# EAGLE design esp12_shield (EAGLE 6.5.0)
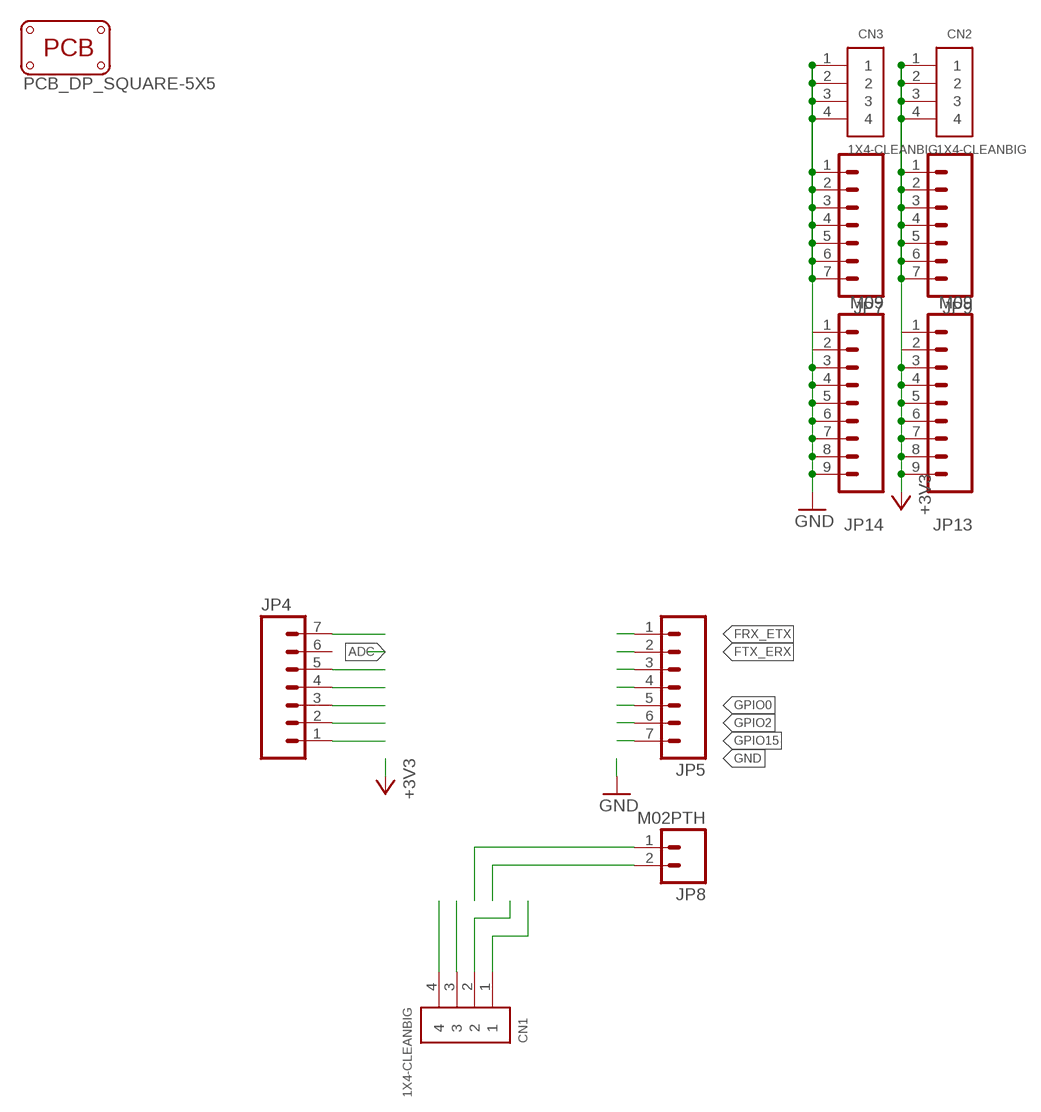
[diagram p0: schematic, sheet 1]

## Parts
CN1  1X4-CLEANBIG  [1X04-CLEANBIG]
CN2  1X4-CLEANBIG  [1X04-CLEANBIG]
CN3  1X4-CLEANBIG  [1X04-CLEANBIG]
JP4  M07  [1X07]
JP5  M07  [1X07]
JP7  M07  [1X07]
JP8  M02PTH  [1X02]
JP9  M07  [1X07]
JP13  M09  [1X09]
JP14  M09  [1X09]
PCB1  PCB_DP_SQUARE-5X5  [DP5050_V1]

## Nets
+3V3: CN2.1 CN2.2 CN2.3 CN2.4 JP9.1 JP9.2 JP9.3 JP9.4 JP9.5 JP9.6 JP9.7 JP13.1 JP13.2 JP13.3 JP13.4 JP13.5 JP13.6 JP13.7 JP13.8 JP13.9
CH_PD: JP4.5
FRX_ETX: JP5.1
FTX_ERX: JP5.2
GND: CN3.1 CN3.2 CN3.3 CN3.4 JP7.1 JP7.2 JP7.3 JP7.4 JP7.5 JP7.6 JP7.7 JP14.1 JP14.2 JP14.3 JP14.4 JP14.5 JP14.6 JP14.7 JP14.8 JP14.9
GPIO0: JP5.5
GPIO2: JP5.6
GPIO15: JP5.7
N$1: JP4.7
N$2: CN1.4
N$3: JP4.1
N$4: JP4.2
N$5: JP4.3
N$6: CN1.3
N$7: JP4.4
N$10: CN1.2
N$11: CN1.1
N$14: JP5.4
N$15: JP5.3
N$16: JP8.1
N$17: JP8.2
Unconnected: JP4.6

## Library data of the parts
CN1-CN3 = adafruit:1X4: 4-pin connector
JP4 JP5 JP7 JP9 = SparkFun-Connectors:M07: Header 7 Standard 7-pin 0.1" header. Use with straight break away headers (SKU : PRT-00116), right angle break away headers (PRT-00553), swiss pins (PRT-00743), machine pins (PRT-00117), and female headers (PRT-00115). NOTES ON THE VARIANTS LOCK and LOCK_LONGPADS... This footprint was designed to help hold the alignment of a through-hole component (i.e. 7-pin header) while soldering it into place. You may notice that each hole has been shifted either up or down by 0.005 of an inch from it's more standard position (which is usually a perfectly straight line). This slight alteration caused the pins (the squares in the middle) to touch the edges of the holes. Because they are alternating, it causes a "brace" to hold the header in place. 0.005 has proven to be the perfect amount of "off-center" position when using our standard breakaway headers. Although looks a little odd when you look at the bare footprint, once you have a header in there, the alteration is very hard to notice. Also, if you push a header all the way into place, it is covered up entirely on the bottom side. This idea of altering the position of holes to aid alignment will be further integrated into the Sparkfun Library for other footprints. It can help hold any component with 3 or more connection pins.
JP8 = SparkFun-Connectors:M02: Standard 2-pin 0.1" header. Use with - straight break away headers ( PRT-00116) - right angle break away headers (PRT-00553) - swiss pins (PRT-00743) - machine pins (PRT-00117) - female headers (PRT-00115) Molex polarized connector foot print use with: PRT-08233 with associated crimp pins and housings. 2.54_SCREWTERM for use with PRT-10571. 3.5mm Screw Terminal footprints for PRT-08084 5mm Screw Terminal footprints for use with PRT-08432
JP13 JP14 = SparkFun-Connectors:M09: Header 9 Standard 9-pin 0.1" header. Use with straight break away headers (SKU : PRT-00116), right angle break away headers (PRT-00553), swiss pins (PRT-00743), machine pins (PRT-00117), and female headers (PRT-00115).
PCB1 = dp_pcb:PCB_DP_SQUARE: Dangerous Prototypes Standard Square PCB sizes

## Board
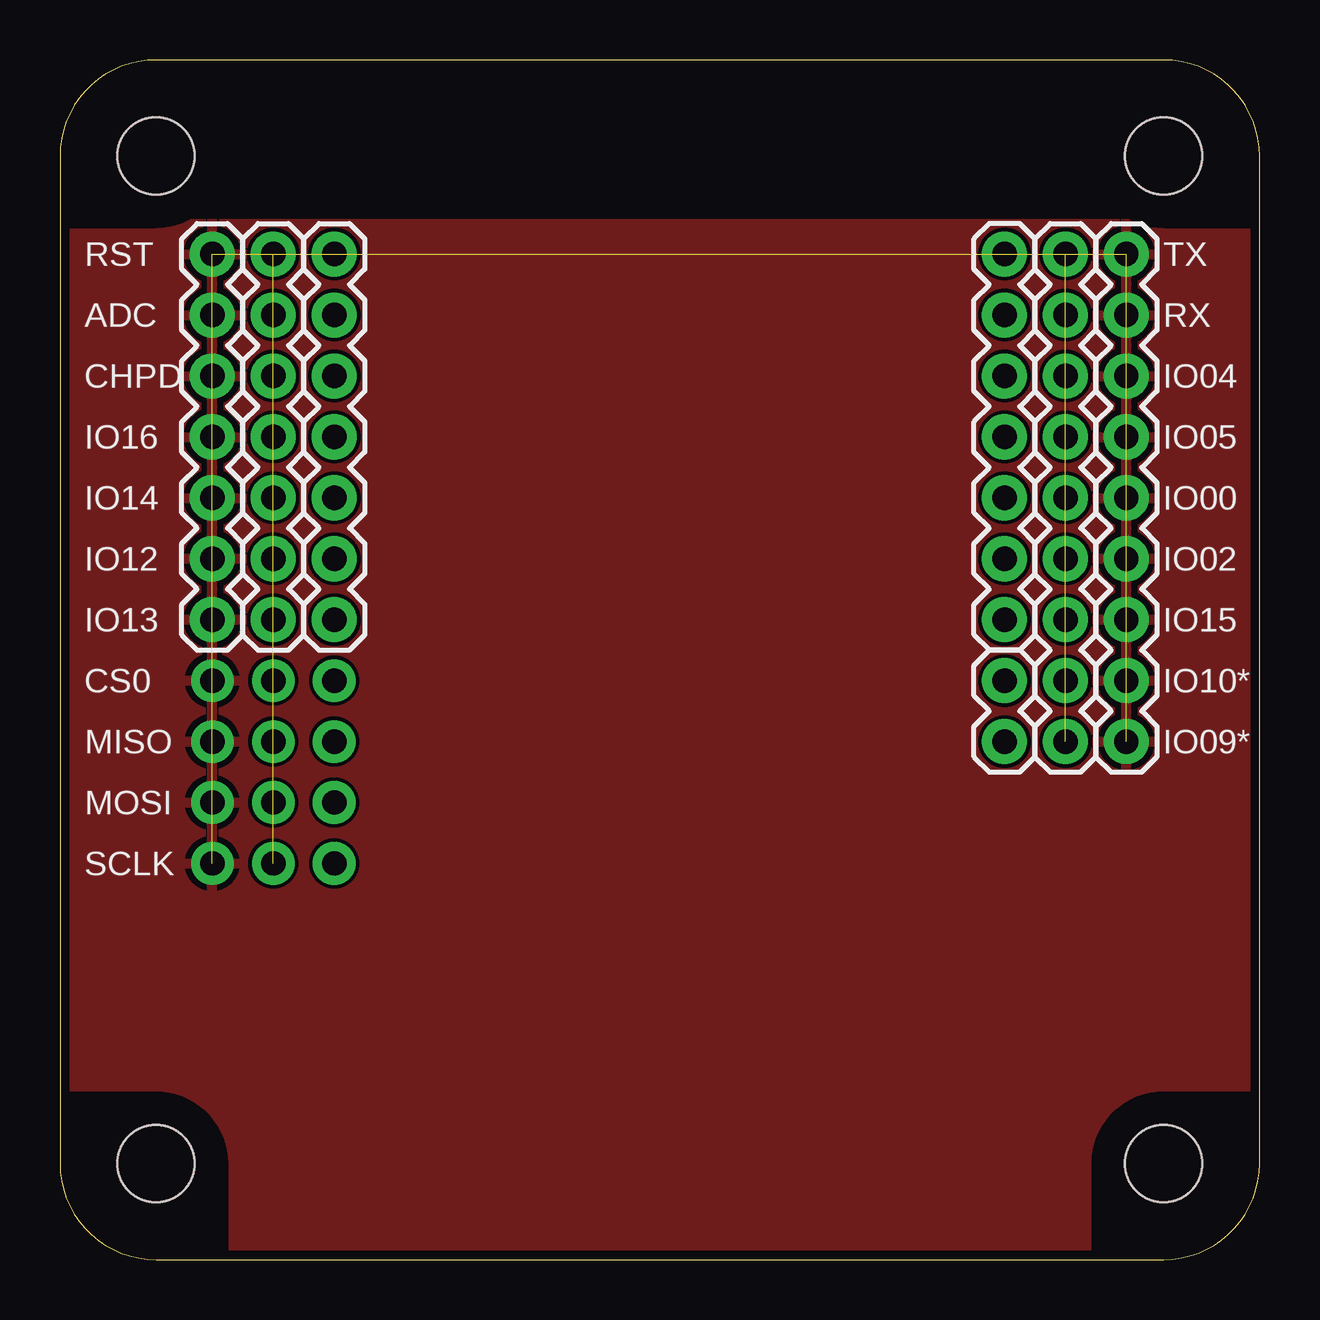
[diagram p1: board, top side]
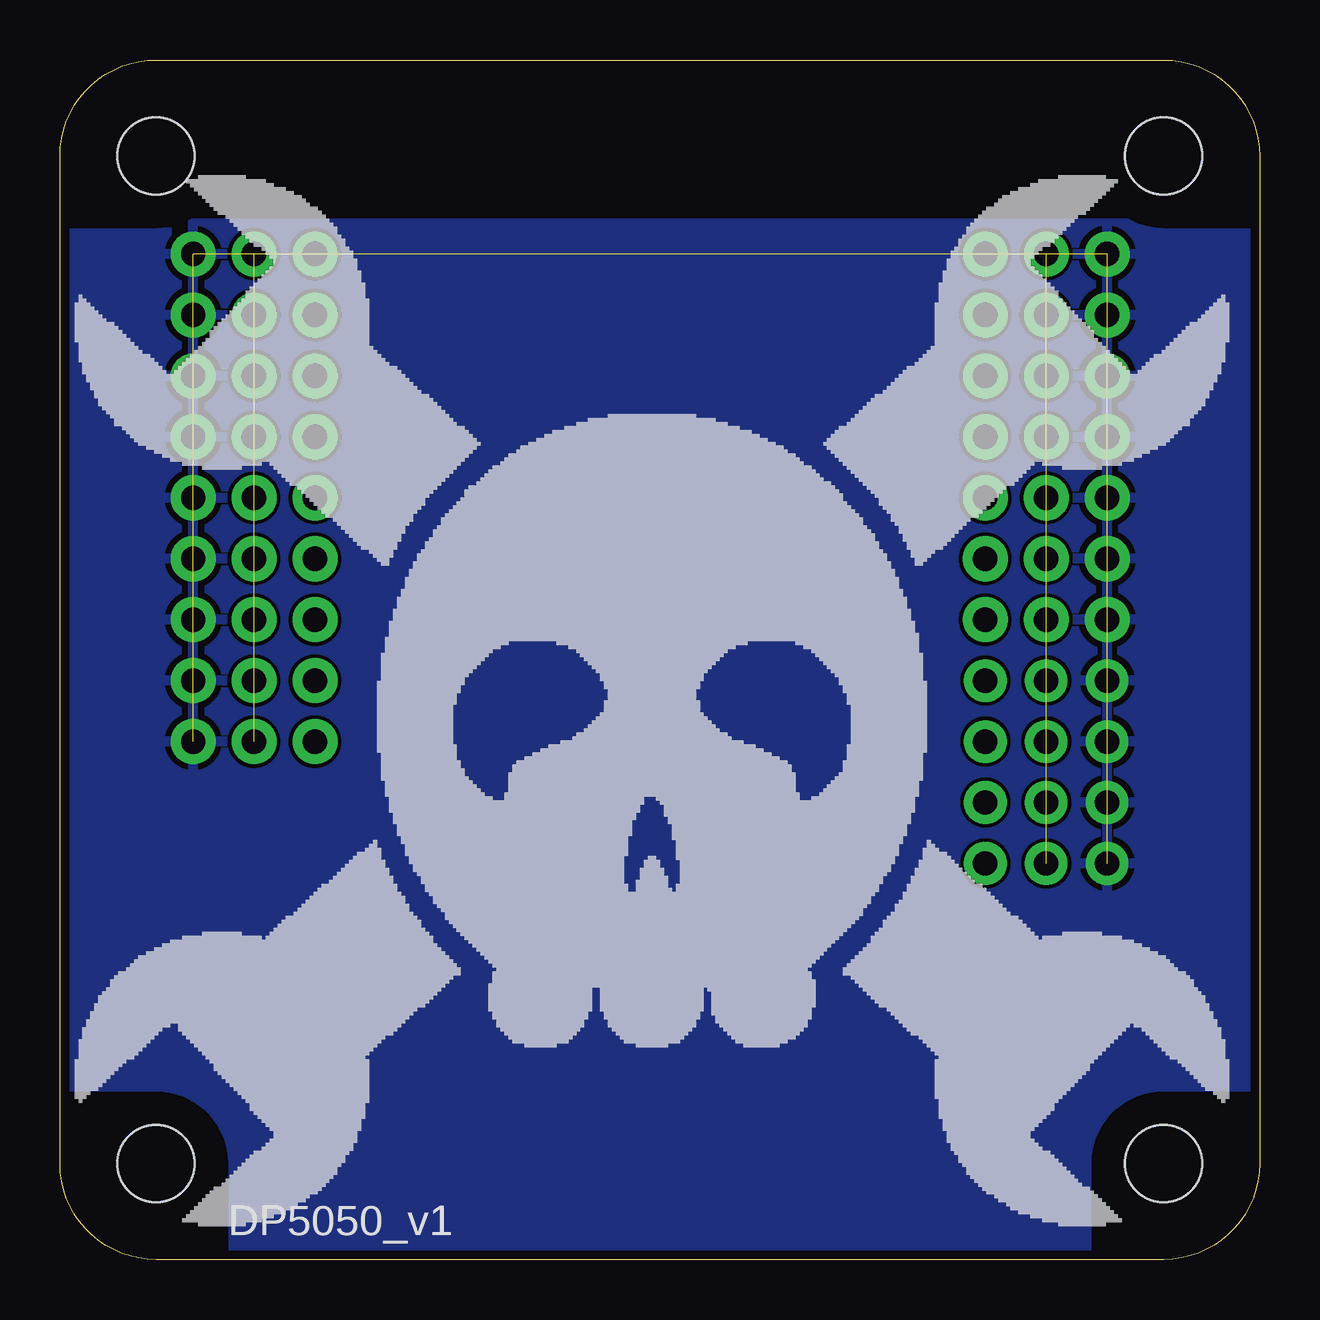
[diagram p2: board, bottom side, seen from below]

Size 50 x 50 mm. Coordinates in mm from the lower left corner, seen from the top.
Copper layers (1*16): Top 0.0356mm / dielectric 1.5011mm / Bottom 0.0356mm
Design rules "LaenPCBOrder *": minimum track width 6mil, minimum drill 13mil, track to track 6mil, track to pad 6mil, pad to pad 6mil, via to via 6mil, smd to smd 6mil, copper to edge 15mil, drill to drill 6mil, minimum pad ring 7mil, minimum via ring 7mil, stop-mask expansion 3mil, vias tented up to drill 1000mil, thermal gap 10mil

### Footprints (pad centres in the part's own frame; a part is rotated, then mirrored left to right if it is on the bottom)
1X04-CLEANBIG = drill 1.016 pad 1.778: 1 -3.81,0; 2 -1.27,0; 3 1.27,0; 4 3.81,0
1X07 = drill 1.016 pad 1.88: 1 0,0; 2 2.54,0; 3 5.08,0; 4 7.62,0; 5 10.16,0; 6 12.7,0; 7 15.24,0
1X02 = drill 1.016 pad 1.88: 1 0,0; 2 2.54,0
1X09 = drill 1.016 pad 1.88: 1 0,0; 2 2.54,0; 3 5.08,0; 4 7.62,0; 5 10.16,0; 6 12.7,0; 7 15.24,0; 8 17.78,0; 9 20.32,0
DP5050_V1 = hole 3.2: 4,4; 46,4; 46,46; 4,46

### Placement (x,y rotation side)
CN1  11.43,20.32 90 top
CN2  8.89,20.32 90 top
CN3  6.35,20.32 90 top
JP4  11.43,26.67 90 top
JP5  39.37,41.91 270 top
JP7  6.35,26.67 90 top
JP8  39.37,21.59 90 top
JP9  8.89,26.67 90 top
JP13  41.91,21.59 90 top
JP14  44.45,21.59 90 top
PCB1  0,0 0 top

### Tracks (layer width: path | path; a pad name or v marks a point on that pad's centre or on a via)
+3V3  (19 unrouted)
GND  (19 unrouted)
  pour Top: -5.08,43.18 55.88,43.18 55.88,-5.08 -5.08,-5.08
  pour Bottom: -2.54,43.18 53.34,43.18 53.34,-2.54 -2.54,-2.54

### Text on the board
tNames: RST | TX | ADC | RX | CHPD | IO04 | IO16 | IO05 | IO14 | IO00 | IO12 | IO02 | IO13 | IO15 | CS0 | IO10* | MISO | IO09* | MOSI | SCLK